# EAGLE schematic power_supply (EAGLE 8.2.1)
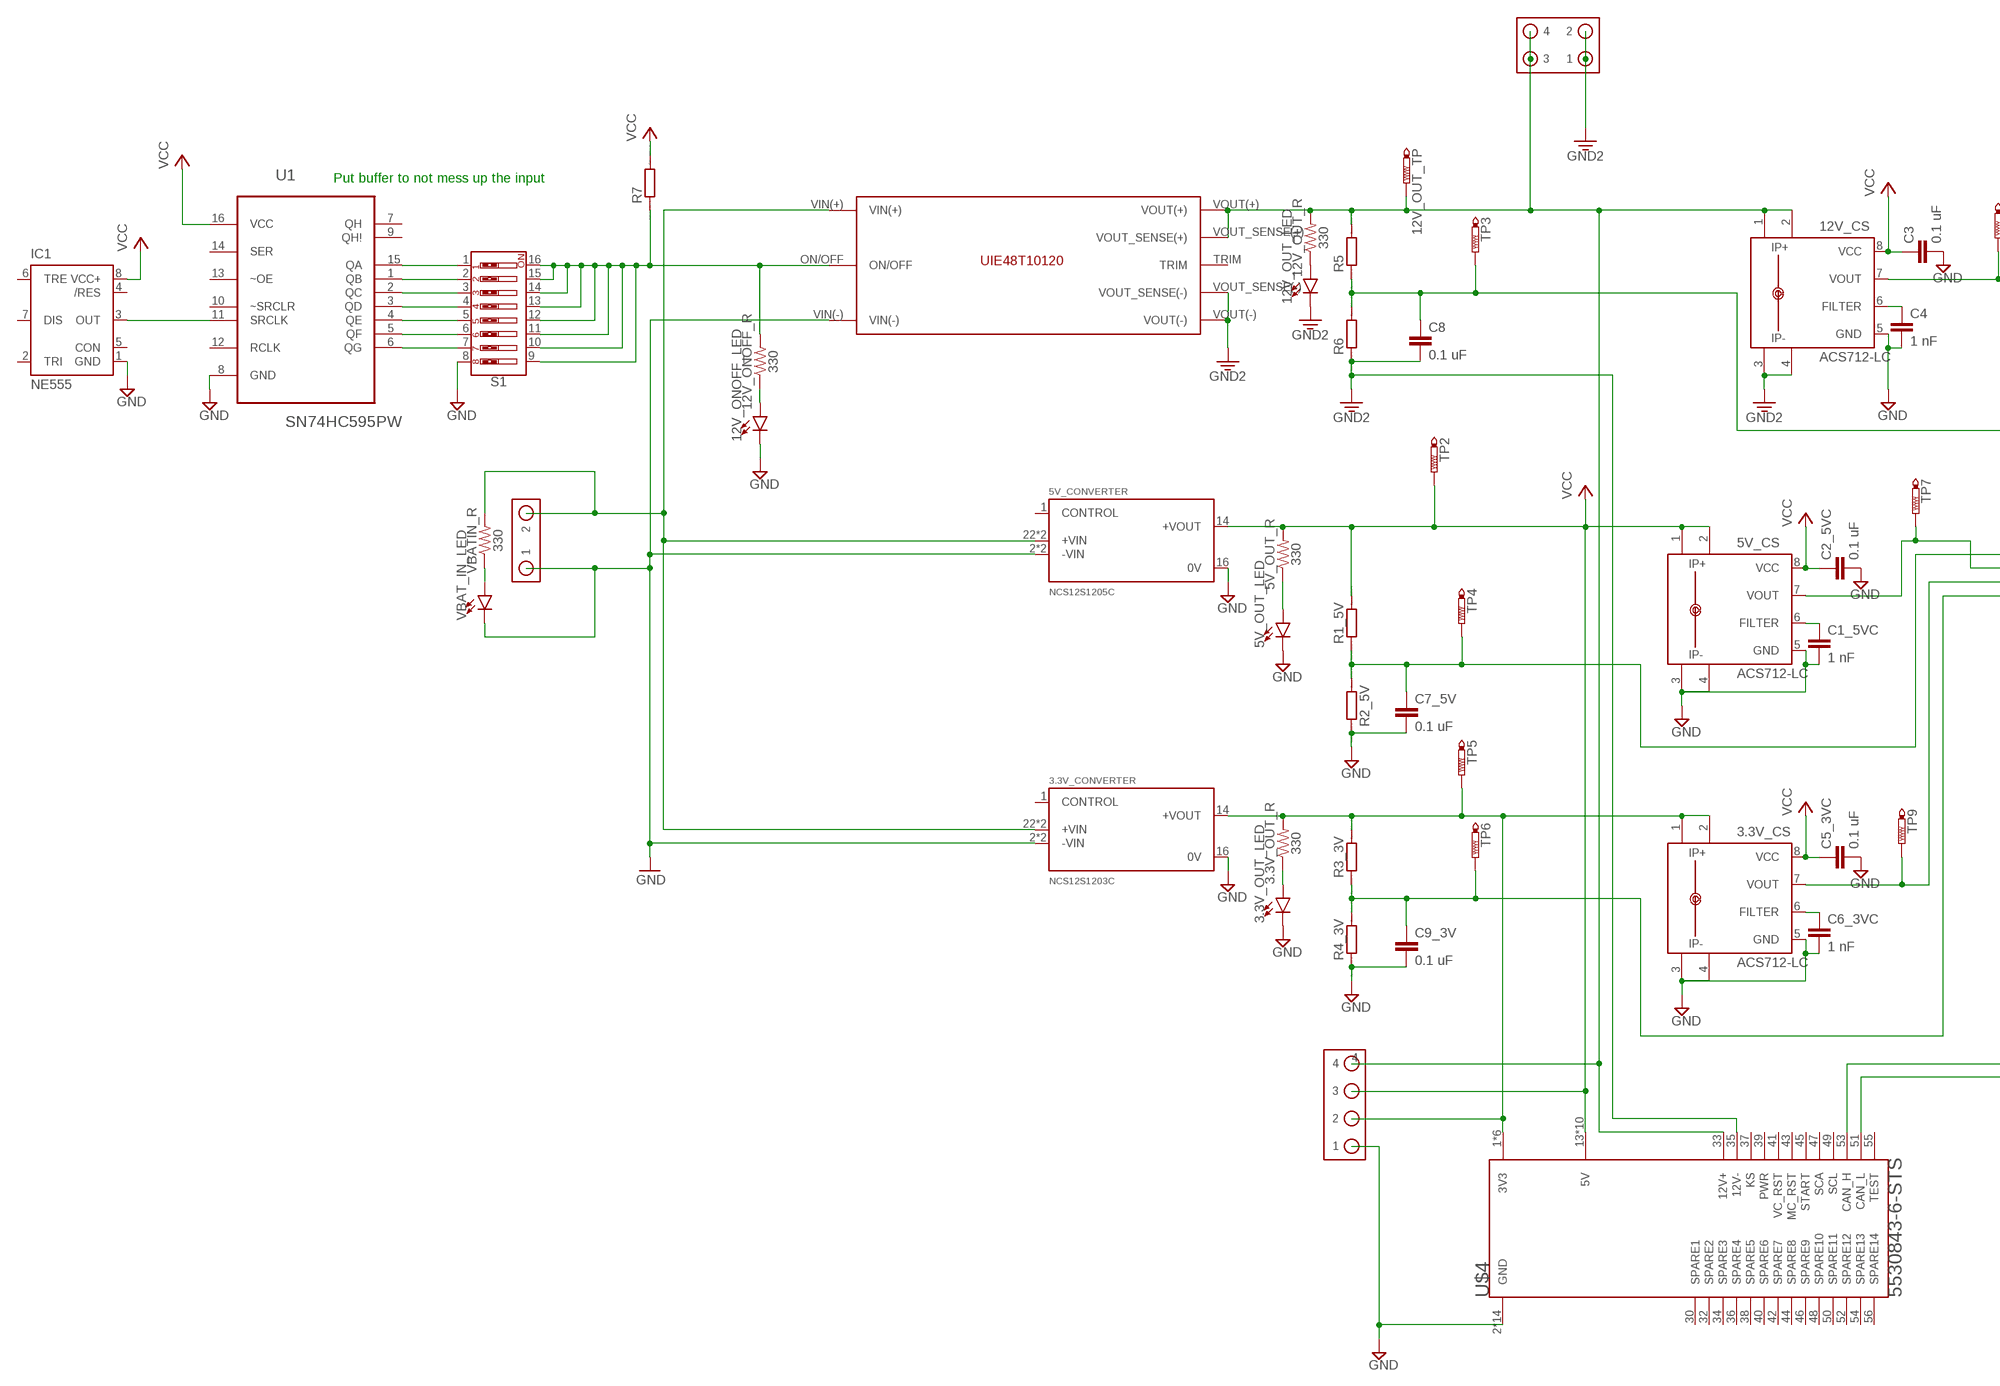
[diagram p0: schematic, sheet 1, part 1 of 2]
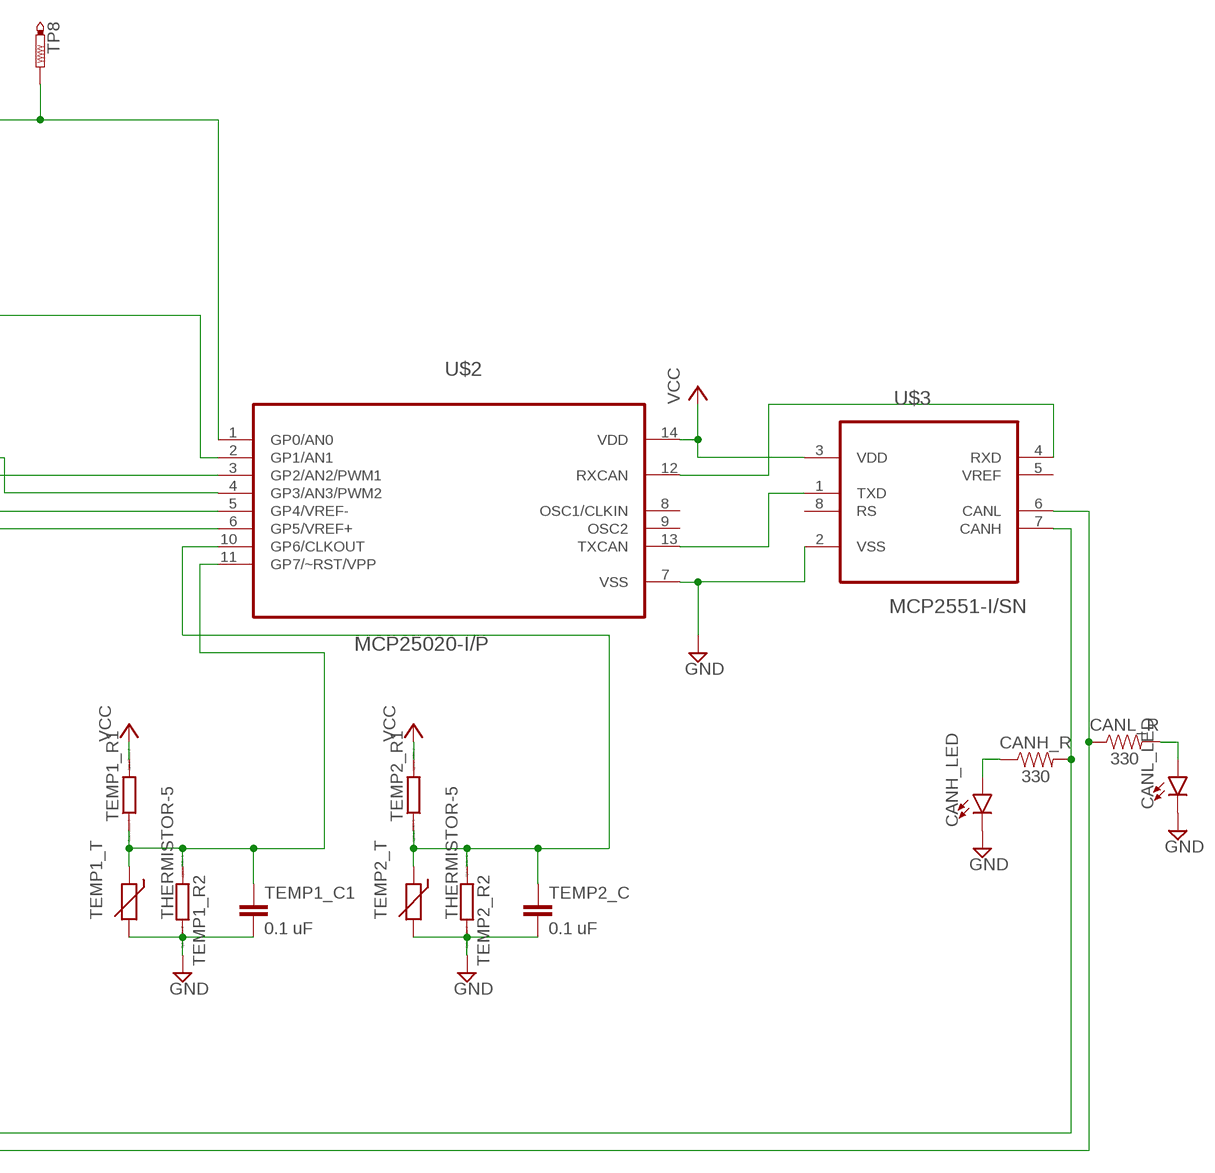
[diagram p1: schematic, sheet 1, part 2 of 2]

## Parts
3.3V_CONVERTER  NCS12S1203C  [CONV_NCS12S1203C]
3.3V_CS  ACS712-LC  [SOIC8]
3.3V_OUT_LED  LED1206  [LED-1206]
3.3V_OUT_R  330  0OHM-0603-1/10W-5%  [0603]
5V_CONVERTER  NCS12S1205C  [CONV_NCS12S1205C]
5V_CS  ACS712-LC  [SOIC8]
5V_OUT_LED  LED1206  [LED-1206]
5V_OUT_R  330  0OHM-0603-1/10W-5%  [0603]
12V_CS  ACS712-LC  [SOIC8]
12V_ONOFF_LED  LED1206  [LED-1206]
12V_ONOFF_R  330  0OHM-0603-1/10W-5%  [0603]
12V_OUT_LED  LED1206  [LED-1206]
12V_OUT_R  330  0OHM-0603-1/10W-5%  [0603]
12V_OUT_TP  PTR1B1,27  [B1,27]
C1_5VC  1 nF  C2.5/2  [C2.5-2]
C2_5VC  0.1 uF  C2.5/2  [C2.5-2]
C3  0.1 uF  C2.5/2  [C2.5-2]
C4  1 nF  C2.5/2  [C2.5-2]
C5_3VC  0.1 uF  C2.5/2  [C2.5-2]
C6_3VC  1 nF  C2.5/2  [C2.5-2]
C7_5V  0.1 uF  C2.5/2  [C2.5-2]
C8  0.1 uF  C2.5/2  [C2.5-2]
C9_3V  0.1 uF  C2.5/2  [C2.5-2]
CANH_LED  LED1206  [LED-1206]
CANH_R  330  0OHM-0603-1/10W-5%  [0603]
CANL_LED  LED1206  [LED-1206]
CANL_R  330  0OHM-0603-1/10W-5%  [0603]
IC1  NE555  [DIL-08]
R1_5V  R0204/7  [0204/7]
R2_5V  R0204/7  [0204/7]
R3_3V  R0204/7  [0204/7]
R4_3V  R0204/7  [0204/7]
R5  R0204/7  [0204/7]
R6  R0204/7  [0204/7]
R7  R0204/7  [0204/7]
S1  DIP-08-PTH  [DIPSWITCH-08]
TEMP1_C1  0.1 uF  C2.5/2  [C2.5-2]
TEMP1_R1  R0204/7  [0204/7]
TEMP1_R2  R0204/7  [0204/7]
TEMP1_T  THERMISTOR-5  [R-5]
TEMP2_C  0.1 uF  C2.5/2  [C2.5-2]
TEMP2_R1  R0204/7  [0204/7]
TEMP2_R2  R0204/7  [0204/7]
TEMP2_T  THERMISTOR-5  [R-5]
TP2  PTR1B1,27  [B1,27]
TP3  PTR1B1,27  [B1,27]
TP4  PTR1B1,27  [B1,27]
TP5  PTR1B1,27  [B1,27]
TP6  PTR1B1,27  [B1,27]
TP7  PTR1B1,27  [B1,27]
TP8  PTR1B1,27  [B1,27]
TP9  PTR1B1,27  [B1,27]
U1  SN74HC595PW  [SOP65P640X120-16N]
U$1  UIE48T10120  [UIE48T10120]
U$2  MCP25020-I/P  [DIP254P762X432-14]
U$3  MCP2551-I/SN  [SOIC127P600X175-8N]
U$4  5530843-6-STS  [5530843-6-BOARD]
U$5  39-30-1020  [5569-02A2]
U$6  39-30-1040  [5569-04A2]
U$7  70555-0003  [70555-0003]
VBAT_IN_LED  LED1206  [LED-1206]
VBATIN_R  330  0OHM-0603-1/10W-5%  [0603]

## Nets
3.3V_ANA_CUR_OUT: 3.3V_CS.7(VOUT) TP9.TP U$2.5(GP4/VREF-)
3.3V_OUT [3.3V_class]: 3.3V_CONVERTER.14(+VOUT) 3.3V_CS.1(IP+) 3.3V_CS.2(IP+1) 3.3V_OUT_R.2 R3_3V.2 TP5.TP U$4.1(3V3) U$4.3(3V3) U$4.5(3V3) U$4.7(3V3) U$4.9(3V3) U$4.11(3V3) U$7.2
3.3V_OUT_LED: 3.3V_OUT_LED.A 3.3V_OUT_R.1
3V_VOL_ANA_OUT: C9_3V.1 R3_3V.1 R4_3V.2 TP6.TP U$2.6(GP5/VREF+)
5V_CUR_ANA_OUT: 5V_CS.7(VOUT) TP7.TP U$2.4(GP3/AN3/PWM2)
5V_OUT_LED: 5V_OUT_LED.A 5V_OUT_R.1
5V_VOL_ANA_OUT: C7_5V.1 R1_5V.1 R2_5V.1 TP4.TP U$2.3(GP2/AN2/PWM1)
12V_CON_ONOFF: 12V_ONOFF_R.2 R7.1 S1.9 S1.10 S1.11 S1.12 S1.13 S1.14 S1.15 S1.16 U$1.ON/OFF
12V_CUR_ANA_OUT: 12V_CS.7(VOUT) TP8.TP U$2.1(GP0/AN0)
12V_FILTER: 12V_CS.6(FILTER) C4.1
12V_GND: 12V_CS.3(IP-) 12V_CS.4(IP-1) 12V_OUT_LED.C C8.2 R6.1 U$1.VOUT(-) U$1.VOUT_SENSE(-) U$4.35(12V-) U$6.3 U$6.4 ; supply symbol labelled GND2
12V_ONOFF_LED: 12V_ONOFF_LED.A 12V_ONOFF_R.1
12V_OUT: 12V_CS.1(IP+) 12V_CS.2(IP+1) 12V_OUT_R.2 12V_OUT_TP.TP R5.2 U$1.VOUT(+) U$1.VOUT_SENSE(+) U$4.33(12V+) U$6.1 U$6.2 U$7.4
12V_OUT_LED: 12V_OUT_LED.A 12V_OUT_R.1
12V_VOL_ANA_OUT: C8.1 R5.1 R6.2 TP3.TP U$2.2(GP1/AN1)
CANH_LED: CANH_LED.A CANH_R.1
CANH_OUT: CANH_R.2 U$3.7(CANH) U$4.53(CAN_H)
CANL_LED: CANL_LED.A CANL_R.2
CANL_OUT: CANL_R.1 U$3.6(CANL) U$4.51(CAN_L)
FILTER_3V: 3.3V_CS.6(FILTER) C6_3VC.1
FILTER_5V: 5V_CS.6(FILTER) C1_5VC.1
GND [GND]: 3.3V_CONVERTER.16(0V) 3.3V_CS.3(IP-) 3.3V_CS.4(IP-1) 3.3V_CS.5(GND) 3.3V_OUT_LED.C 5V_CONVERTER.16(0V) 5V_CS.3(IP-) 5V_CS.4(IP-1) 5V_CS.5(GND) 5V_OUT_LED.C 12V_CS.5(GND) 12V_ONOFF_LED.C C1_5VC.2 C2_5VC.2 C3.2 C4.2 C5_3VC.2 C6_3VC.2 C7_5V.2 C9_3V.2 CANH_LED.C CANL_LED.C IC1.1(GND) R2_5V.2 R4_3V.1 S1.8 TEMP1_C1.2 TEMP1_R2.2 TEMP1_T.2 TEMP2_C.2 TEMP2_R2.2 TEMP2_T.2 U1.8(GND) U$2.7(VSS) U$3.2(VSS) U$4.2(GND) U$4.4(GND) U$4.6(GND) U$4.8(GND) U$4.10(GND) U$4.12(GND) U$4.14(GND) U$4.16(GND) U$4.18(GND) U$4.20(GND) U$4.22(GND) U$4.24(GND) U$4.26(GND) U$4.28(GND) U$7.1
N$2: S1.1 U1.15(QA)
N$6: S1.2 U1.1(QB)
N$7: S1.3 U1.2(QC)
N$8: S1.4 U1.3(QD)
N$9: S1.5 U1.4(QE)
N$10: S1.6 U1.5(QF)
N$11: S1.7 U1.6(QG)
N$13: IC1.3(OUT) U1.11(SRCLK)
N$14: U$2.13(TXCAN) U$3.1(TXD)
N$15: U$2.12(RXCAN) U$3.4(RXD)
TEMP1_ANA_OUT: TEMP1_C1.1 TEMP1_R1.1 TEMP1_R2.1 TEMP1_T.1 U$2.11(GP7/~RST/VPP)
TEMP2_ANA_OUT: TEMP2_C.1 TEMP2_R1.1 TEMP2_R2.1 TEMP2_T.1 U$2.10(GP6/CLKOUT)
V_BAT_BAL+: 3.3V_CONVERTER.22(+VIN) 3.3V_CONVERTER.23(+VIN) 5V_CONVERTER.22(+VIN) 5V_CONVERTER.23(+VIN) U$1.VIN(+) U$5.2 VBATIN_R.2
V_BAT_BAL-: 3.3V_CONVERTER.2(-VIN) 3.3V_CONVERTER.3(-VIN) 5V_CONVERTER.2(-VIN) 5V_CONVERTER.3(-VIN) U$1.VIN(-) U$5.1 VBAT_IN_LED.C ; supply symbol labelled GND
VBAT_IN_LED: VBAT_IN_LED.A VBATIN_R.1
VCC: 3.3V_CS.8(VCC) 5V_CONVERTER.14(+VOUT) 5V_CS.1(IP+) 5V_CS.2(IP+1) 5V_CS.8(VCC) 5V_OUT_R.2 12V_CS.8(VCC) C2_5VC.1 C3.1 C5_3VC.1 IC1.8(VCC+) R1_5V.2 R7.2 TEMP1_R1.2 TEMP2_R1.2 TP2.TP U1.16(VCC) U$2.14(VDD) U$3.3(VDD) U$4.13(5V) U$4.15(5V) U$4.17(5V) U$4.19(5V) U$4.21(5V) U$4.23(5V) U$4.25(5V) U$4.27(5V) U$4.29(5V) U$4.31(5V) U$7.3
Unconnected: 3.3V_CONVERTER.1(CONTROL) 5V_CONVERTER.1(CONTROL) IC1.2(TRI) IC1.4(/RES) IC1.5(CON) IC1.6(TRE) IC1.7(DIS) U1.7(QH) U1.9(QH!) U1.10(~SRCLR) U1.12(RCLK) U1.13(~OE) U1.14(SER) U$1.TRIM U$2.8(OSC1/CLKIN) U$2.9(OSC2) U$3.5(VREF) U$3.8(RS) U$4.30(SPARE1) U$4.32(SPARE2) U$4.34(SPARE3) U$4.36(SPARE4) U$4.37(KS) U$4.38(SPARE5) U$4.39(PWR) U$4.40(SPARE6) U$4.41(VC_RST) U$4.42(SPARE7) U$4.43(MC_RST) U$4.44(SPARE8) U$4.45(START) U$4.46(SPARE9) U$4.47(SCA) U$4.48(SPARE10) U$4.49(SCL) U$4.50(SPARE11) U$4.52(SPARE12) U$4.54(SPARE13) U$4.55(TEST) U$4.56(SPARE14)

## Notes on the sheet
- Put buffer to not mess up the input

## Library data of the parts
3.3V_CONVERTER = NCS12S1205C:NCS12S1203C
3.3V_CS 5V_CS 12V_CS = allegro-2:ACS712-LC
3.3V_OUT_LED 5V_OUT_LED 12V_ONOFF_LED 12V_OUT_LED CANH_LED CANL_LED VBAT_IN_LED = SparkFun-LED:LED: LED (Generic) Standard schematic elements and footprints for 5mm, 3mm, 1206, and 0603 sized LEDs. Generic LEDs with no color specified.
3.3V_OUT_R 5V_OUT_R 12V_ONOFF_R 12V_OUT_R CANH_R CANL_R VBATIN_R = SparkFun-Resistors:0OHM: 0Ω resistor A resistor is a passive two-terminal electrical component that implements electrical resistance as a circuit element. Resistors act to reduce current flow, and, at the same time, act to lower voltage levels within circuits. - Wikipedia; PROD_ID: RES-08609; VALUE: 0
5V_CONVERTER = NCS12S1205C:NCS12S1205C: Isolated Board Mount DC/DC Converter, DIP, Fixed, Through Hole, 12 W, 5 V, 2.4 A; AVAILABILITY: Bad; DESCRIPTION: Isolated Board Mount DC/DC Converter%2C DIP%2C Fixed%2C Through Hole%2C 12 W%2C 5 V%2C 2.4 A; MF: Murata Power Solutions; MP: NCS12S1205C; PACKAGE: DIP-8 Murata Power Solutions; PRICE: 28.15 USD
12V_OUT_TP TP2-TP9 = testpad:PTR1: TEST PIN
C1_5VC C2_5VC C3 C4 C5_3VC C6_3VC C7_5V C8 C9_3V TEMP1_C1 TEMP2_C = capacitor-wima:C: CAPACITOR naming: grid - package width
IC1 = st-microelectronics:NE555: General purpose bipolar Timer; MF: Arrow Electronics; MPN: NE555N; OC_FARNELL: 1467742; OC_NEWARK: 89K1486
R1_5V R2_5V R3_3V R4_3V R5-R7 TEMP1_R1 TEMP1_R2 TEMP2_R1 TEMP2_R2 = eagle-ltspice:R: RESISTOR, European symbol; SPICEMODEL: NONE; SPICEPREFIX: R
S1 = SparkFun-Switches:DIP-08: 8-Position DIP Switch 8-circuit DIP (dual inline package) switch. Commonly used to physcially set a circuit's behavior. SparkFun Products DIP Switch - 8 Position <https://www.sparkfun.com/products/8034> (COM-08034); PROD_ID: SWCH-12197; SF_SKU: COM-08034
TEMP1_T TEMP2_T = varistor:THERMISTOR: THERMISTOR
U1 = SN74HC595PW:SN74HC595PW: 8-BIT SHIFT REGISTERS WITH 3-STATE OUTPUT REGISTERS; AVAILABILITY: Good; DESCRIPTION: Shift Register Single 8-Bit Serial to Serial/Parallel 16-Pin TSSOP Tube; MF: Texas Instruments; MP: SN74HC595PW; PACKAGE: SOIC-16 Texas Instruments; PRICE: 0.29 USD
U$1 = NCS12S1205C:UIE48T10120
U$2 = MCP25020-I_P:MCP25020-I/P: CAN I/O Expander Family; AVAILABILITY: Good; DESCRIPTION: Integrated circuit%3A CAN controller%3B 1Mbps%3B 2.7%C3%B75.5VDC%3B DIP14; MF: Microchip; MP: MCP25020-I/P; PACKAGE: DIP-14 Microchip; PRICE: 2.18 USD
U$3 = MCP2551-I_SN:MCP2551-I/SN: High-Speed CAN Transceiver; AVAILABILITY: Good; DESCRIPTION: MCP2551 Series 5.5 V 1 Mb/s Surface Mount High-Speed CAN Transceiver - SOIC-8; MF: Microchip; MP: MCP2551-I/SN; PACKAGE: SOIC-8 Microchip; PRICE: 0.91 USD
U$4 = te-connectivity:5530843-6-STS
U$5 = molex:39-30-1020
U$6 = molex:39-30-1040
U$7 = molex:70555-0003

## Net classes
1 3.3V_class: clearance 0.127 mm
3 GND: clearance 0.025 mm